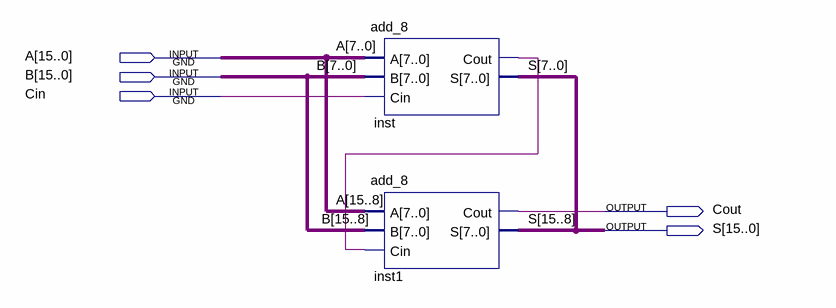
[diagram p0: schematic sheet]
// Quartus schematic add_16.bdf as structural Verilog: 2 symbols, 5 pins
module add_16 (
  input  [15:0] A,
  input  [15:0] B,
  input  Cin,
  output Cout,
  output [15:0] S
);

  wire inst_cout;

  add_8 inst (.A(A[7:0]), .B(B[7:0]), .Cin(Cin), .Cout(inst_cout), .S(S[7:0]));
  add_8 inst1 (.A(A[15:8]), .B(B[15:8]), .Cin(inst_cout), .Cout(Cout), .S(S[15:8]));
endmodule
